# Altium schematic sheet Sheet1.SchDoc
size A3; SheetNumber: 1; SheetTotal: 2
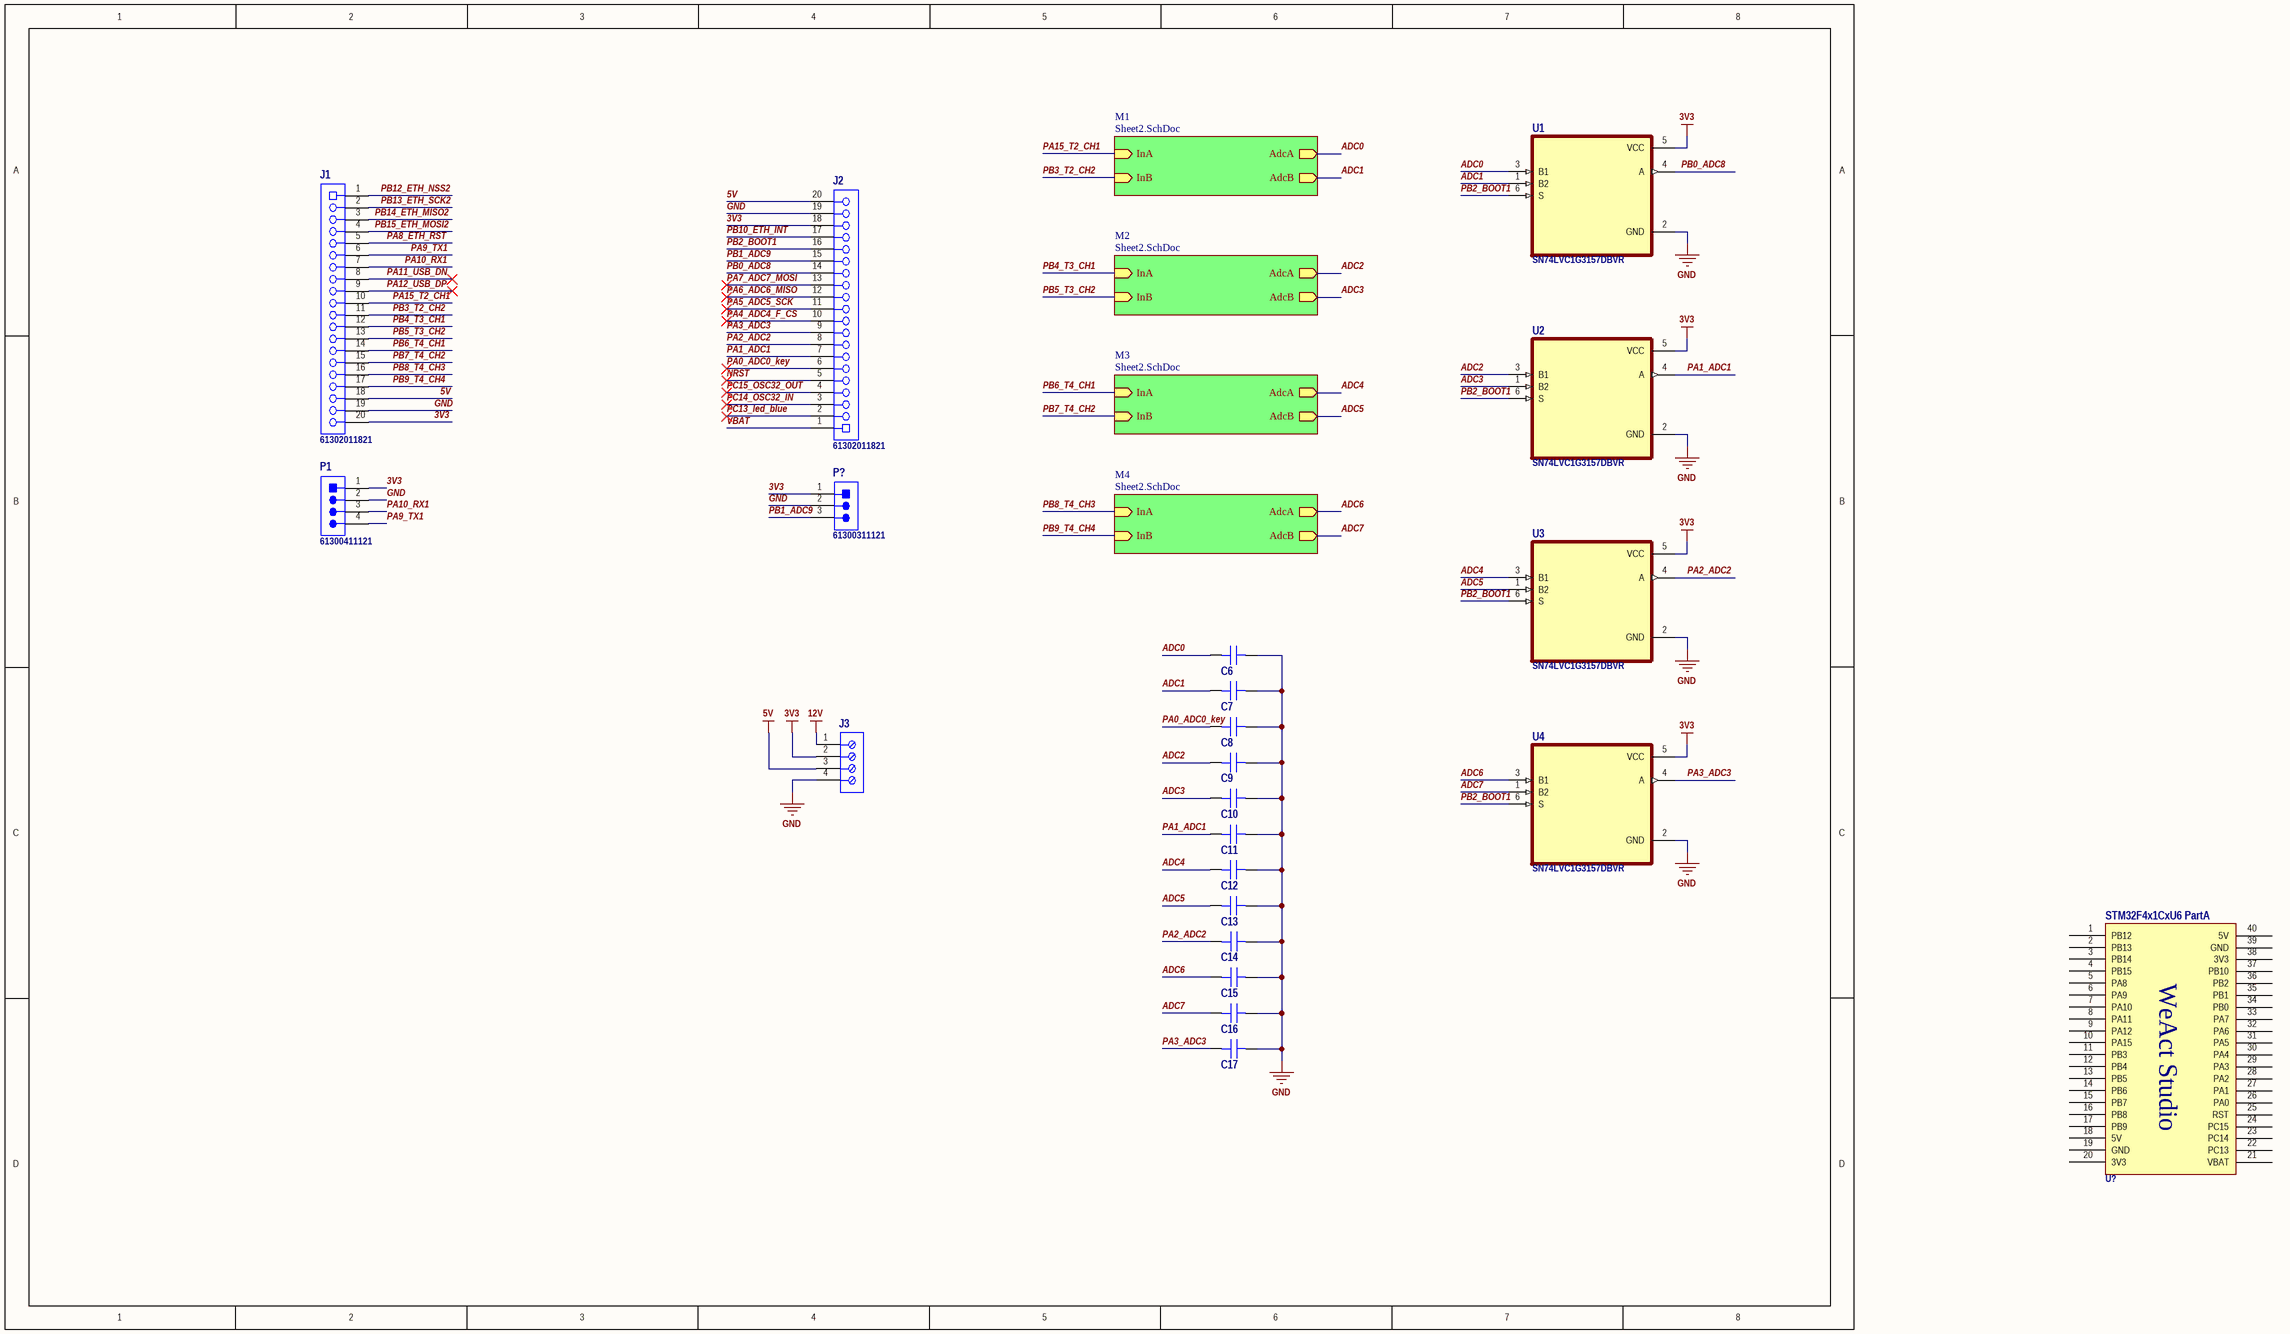
[diagram p0: Sheet1.SchDoc]

## Parts
C6  0.1 µF  [CAP 0603_1608]  (value not drawn)
C7  0.1 µF  [CAP 0603_1608]  (value not drawn)
C8  0.1 µF  [CAP 0603_1608]  (value not drawn)
C9  0.1 µF  [CAP 0603_1608]  (value not drawn)
C10  0.1 µF  [CAP 0603_1608]  (value not drawn)
C11  0.1 µF  [CAP 0603_1608]  (value not drawn)
C12  0.1 µF  [CAP 0603_1608]  (value not drawn)
C13  0.1 µF  [CAP 0603_1608]  (value not drawn)
C14  0.1 µF  [CAP 0603_1608]  (value not drawn)
C15  0.1 µF  [CAP 0603_1608]  (value not drawn)
C16  0.1 µF  [CAP 0603_1608]  (value not drawn)
C17  0.1 µF  [CAP 0603_1608]  (value not drawn)
J1  61302011821  [61302011821]
J2  61302011821  [61302011821]
J3  691137910004  [691137910004]  (value not drawn)
P1  61300411121  [61300411121]
P?  61300311121  [61300311121]
STM32F4x1CxU6_Part  U?  [STM32F4x1CxU6 WeActStudio]  (part A of 2)
U1  SN74LVC1G3157DBVR  [SOT95P280X145-6N]
U2  SN74LVC1G3157DBVR  [SOT95P280X145-6N]
U3  SN74LVC1G3157DBVR  [SOT95P280X145-6N]
U4  SN74LVC1G3157DBVR  [SOT95P280X145-6N]

## Sub-sheets
M1 = Sheet2.SchDoc: InA (in), InB (in), AdcB (out), AdcA (out)
M2 = Sheet2.SchDoc: InA (in), InB (in), AdcB (out), AdcA (out)
M3 = Sheet2.SchDoc: InA (in), InB (in), AdcB (out), AdcA (out)
M4 = Sheet2.SchDoc: InA (in), InB (in), AdcB (out), AdcA (out)

## Nets
3V3: J1.20 J2.18 J3.2 P1.1 P?.1 U1.5(VCC) U2.5(VCC) U3.5(VCC) U4.5(VCC)
5V: J1.18 J2.20 J3.3
12V: J3.1
GND: C6.2 C7.2 C8.2 C9.2 C10.2 C11.2 C12.2 C13.2 C14.1 C15.1 C16.1 C17.1 J1.19 J2.19 J3.4 P1.2 P?.2 U1.2(GND) U2.2(GND) U3.2(GND) U4.2(GND)
ADC0: C6.1 U1.3(B1) ; sheet M1/AdcA
ADC1: C7.1 U1.1(B2) ; sheet M1/AdcB
ADC2: C9.1 U2.3(B1) ; sheet M2/AdcA
ADC3: C10.1 U2.1(B2) ; sheet M2/AdcB
ADC4: C12.1 U3.3(B1) ; sheet M3/AdcA
ADC5: C13.1 U3.1(B2) ; sheet M3/AdcB
ADC6: C15.2 U4.3(B1) ; sheet M4/AdcA
ADC7: C16.2 U4.1(B2) ; sheet M4/AdcB
NRST: J2.5
PA0_ADC0_key: C8.1 J2.6
PA1_ADC1: C11.1 J2.7 U2.4(A)
PA2_ADC2: C14.2 J2.8 U3.4(A)
PA3_ADC3: C17.2 J2.9 U4.4(A)
PA4_ADC4_F_CS: J2.10
PA5_ADC5_SCK: J2.11
PA6_ADC6_MISO: J2.12
PA7_ADC7_MOSI: J2.13
PA8_ETH_RST: J1.5
PA9_TX1: J1.6 P1.4
PA10_RX1: J1.7 P1.3
PA11_USB_DN: J1.8
PA12_USB_DP: J1.9
PA15_T2_CH1: J1.10 ; sheet M1/InA
PB0_ADC8: J2.14 U1.4(A)
PB1_ADC9: J2.15 P?.3
PB2_BOOT1: J2.16 U1.6(S) U2.6(S) U3.6(S) U4.6(S)
PB3_T2_CH2: J1.11 ; sheet M1/InB
PB4_T3_CH1: J1.12 ; sheet M2/InA
PB5_T3_CH2: J1.13 ; sheet M2/InB
PB6_T4_CH1: J1.14 ; sheet M3/InA
PB7_T4_CH2: J1.15 ; sheet M3/InB
PB8_T4_CH3: J1.16 ; sheet M4/InA
PB9_T4_CH4: J1.17 ; sheet M4/InB
PB10_ETH_INT: J2.17
PB12_ETH_NSS2: J1.1
PB13_ETH_SCK2: J1.2
PB14_ETH_MISO2: J1.3
PB15_ETH_MOSI2: J1.4
PC13_led_blue: J2.2
PC14_OSC32_IN: J2.3
PC15_OSC32_OUT: J2.4
VBAT: J2.1

Not connected (* = marked no-connect by the designer): STM32F4x1CxU6_Part 1(PB12) 2(PB13) 3(PB14) 4(PB15) 5(PA8) 6(PA9) 7(PA10) 8(PA11) 9(PA12) 10(PA15) 11(PB3) 12(PB4) 13(PB5) 14(PB6) 15(PB7) 16(PB8) 17(PB9) 18(5V) 19(GND) 20(3V3) 21(VBAT) 22(PC13) 23(PC14) 24(PC15) 25(RST) 26(PA0) 27(PA1) 28(PA2) 29(PA3) 30(PA4) 31(PA5) 32(PA6) 33(PA7) 34(PB0) 35(PB1) 36(PB2) 37(PB10) 38(3V3) 39(GND) 40(5V)

## Library data of the parts
C6-C17 = CC0603KPX7R8BB104: CAP CER 0.1UF 25V X7R 0603; manufacturer: Yageo; Tolerance: ±10%; Part Number: CC0603KPX7R8BB104; Value: 0.1 µF; Applications: General Purpose; Capacitance: 0.1 µF; componentlink1description: Datasheet; componentlink1url: https://www.yageo.com/upload/media/product/productsearch/datasheet/mlcc/UPY-GPHC_X7R_6.3V-to-50V_20.pdf; componentlink2description: DigiKey Link; componentlink2url: https://www.digikey.com/en/products/detail/yageo/CC0603KPX7R8BB104/11491262; Device Package: 0603 (1608 Metric); lastupdated: 06.03.2022 13:58:12; Lifecycle Status: Active; Minimum Order: 1; Mounting Type: Surface Mount, MLCC; Operating Temperature: -55°C ~ 125°C; Package / Case: 0603 (1608 Metric); packaging: TapeAndReel; partid: 35805; Part Status: Active; price: 0.01; series: CC; Size / Dimension: 0.063" L x 0.031" W (1.60mm x 0.80mm); Supplier 1: DigiKey; Supplier Part Number 1: 13-CC0603KPX7R8BB104CT-ND; Temperature Coefficient: X7R; Thickness (Max): 0.035" (0.90mm); Voltage - Rated: 25V
J1 J2 = 61302011821: WR-PHD Socket Header, THT, pitch 2.54mm, Single Row, Vertical, 20p; Manufacturer: Wurth Elektronik; Pin Number: 20; Rated Current: 3A; Working Voltage: 250VAC; Withstanding Voltage: 500VAC; Contact Resistance: 20mOhm; ComponentLink1Description: Manufacturer; ComponentLink1URL: http://www.we-online.de; ComponentLink2Description: Datasheet; ComponentLink2URL: https://www.we-online.com/catalog/datasheet/61302011821.pdf; Manufacturer Part Number: 61302011821; Pitch: 2.54mm; Operating Temperature: -40 to +125degC; Mounting Technology: THT; Packaging: Tray; Gender: Socket Header; Row Number: Single; Orientation: Vertical
J3 = 691137910004: WR-TBL Serie 1379 Horizontal Cable Entry, Pressure Clamp, THT, pitch 7.5mm, 4p; Manufacturer: Wurth Elektronik; Modularity: No; PCB/Cable/Panel: PCB; Pin Number: 4; Rated Current [UL]: 16A; Working Voltage [UL]: 300VAC; ComponentLink1Description: Manufacturer; ComponentLink1URL: http://www.we-online.de; ComponentLink2URL: https://katalog.we-online.de/em/datasheet/691137910004.pdf; ComponentLink2Description: Datasheet; Mounting Technology: THT; Manufacturer Part Number: 691137910004; Packaging: Box; Operating Temperature: -30 to +120degC; Pitch: 7.5mm; Published Date: Feburary 2021; Type: Horizontal; Application: Pressure Clamp
P1 = 61300411121: WR-PHD Pin Header, THT, pitch 2.54mm, Single Row, Vertical, 4p; Manufacturer: Wurth Elektronik; Pin Number: 4; Rated Current: 3A; Working Voltage: 250VAC; Withstanding Voltage: 500VAC; Contact Resistance: 20mOhm; ComponentLink1Description: Manufacturer; ComponentLink1URL: http://www.we-online.de; ComponentLink2Description: Datasheet; ComponentLink2URL: https://www.we-online.com/catalog/datasheet/61300411121.pdf; Manufacturer Part Number: 61300411121; Pitch: 2.54mm; Operating Temperature: -40 to +105degC; Mounting Technology: THT; Packaging: Bag; Gender: Pin Header; Row Number: Single; Orientation: Vertical
P? = 61300311121: WR-PHD Pin Header, THT, pitch 2.54mm, Single Row, Vertical, 3p; Manufacturer: Wurth Elektronik; Pin Number: 3; Rated Current: 3A; Working Voltage: 250VAC; Withstanding Voltage: 500VAC; Contact Resistance: 20mOhm; ComponentLink1Description: Manufacturer; ComponentLink1URL: http://www.we-online.de; ComponentLink2Description: Datasheet; ComponentLink2URL: https://www.we-online.com/catalog/datasheet/61300311121.pdf; Manufacturer Part Number: 61300311121; Pitch: 2.54mm; Operating Temperature: -40 to +105degC; Mounting Technology: THT; Packaging: Bag; Gender: Pin Header; Row Number: Single; Orientation: Vertical
STM32F4x1CxU6_Part = STM32F4x1CxU6 WeActStudio: STM32F4x1CxU6; ComponentLink1Description: WeAct Studio; ComponentLink1URL: WeAct-TC.cn; ComponentLink2Description: MiniF4-STM32F4x1 Github; ComponentLink2URL: https://github.com/WeActTC/MiniF4-STM32F4x1; ComponentLink3Description: MiniF4-STM32F4x1 Gitee; ComponentLink3URL: https://gitee.com/WeAct-TC/MiniF4-STM32F4x1
U1-U4 = SN74LVC1G3157DBVR: 5-V, 2:1 (SPDT), 1-channel general-purpose analog switch 6-SOT-23 -40 to 125; MF: Texas Instruments; Price: None; Value: *; Package: SOT-23-6 Texas Instruments; Mouser-Purchase-URL: https://snapeda.com/shop?store=Mouser&id=366071; SnapEDA_Link: https://www.snapeda.com/parts/SN74LVC1G3157DBVR/Texas%20Instruments/view-part/366071/?ref=snap; DigiKey-Purchase-URL: https://snapeda.com/shop?store=DigiKey&id=366071; Arrow_Electronics-Purchase-URL: https://snapeda.com/shop?store=Arrow+Electronics&id=366071; MP: SN74LVC1G3157DBVR; Texas_Instruments-Purchase-URL: https://snapeda.com/shop?store=Texas+Instruments&id=366071; Availability: Good; Check_prices: https://www.snapeda.com/parts/SN74LVC1G3157DBVR/Texas%20Instruments/view-part/366071/?ref=eda